# EAGLE schematic esp32 with ws2812b strip (EAGLE 9.3.0)
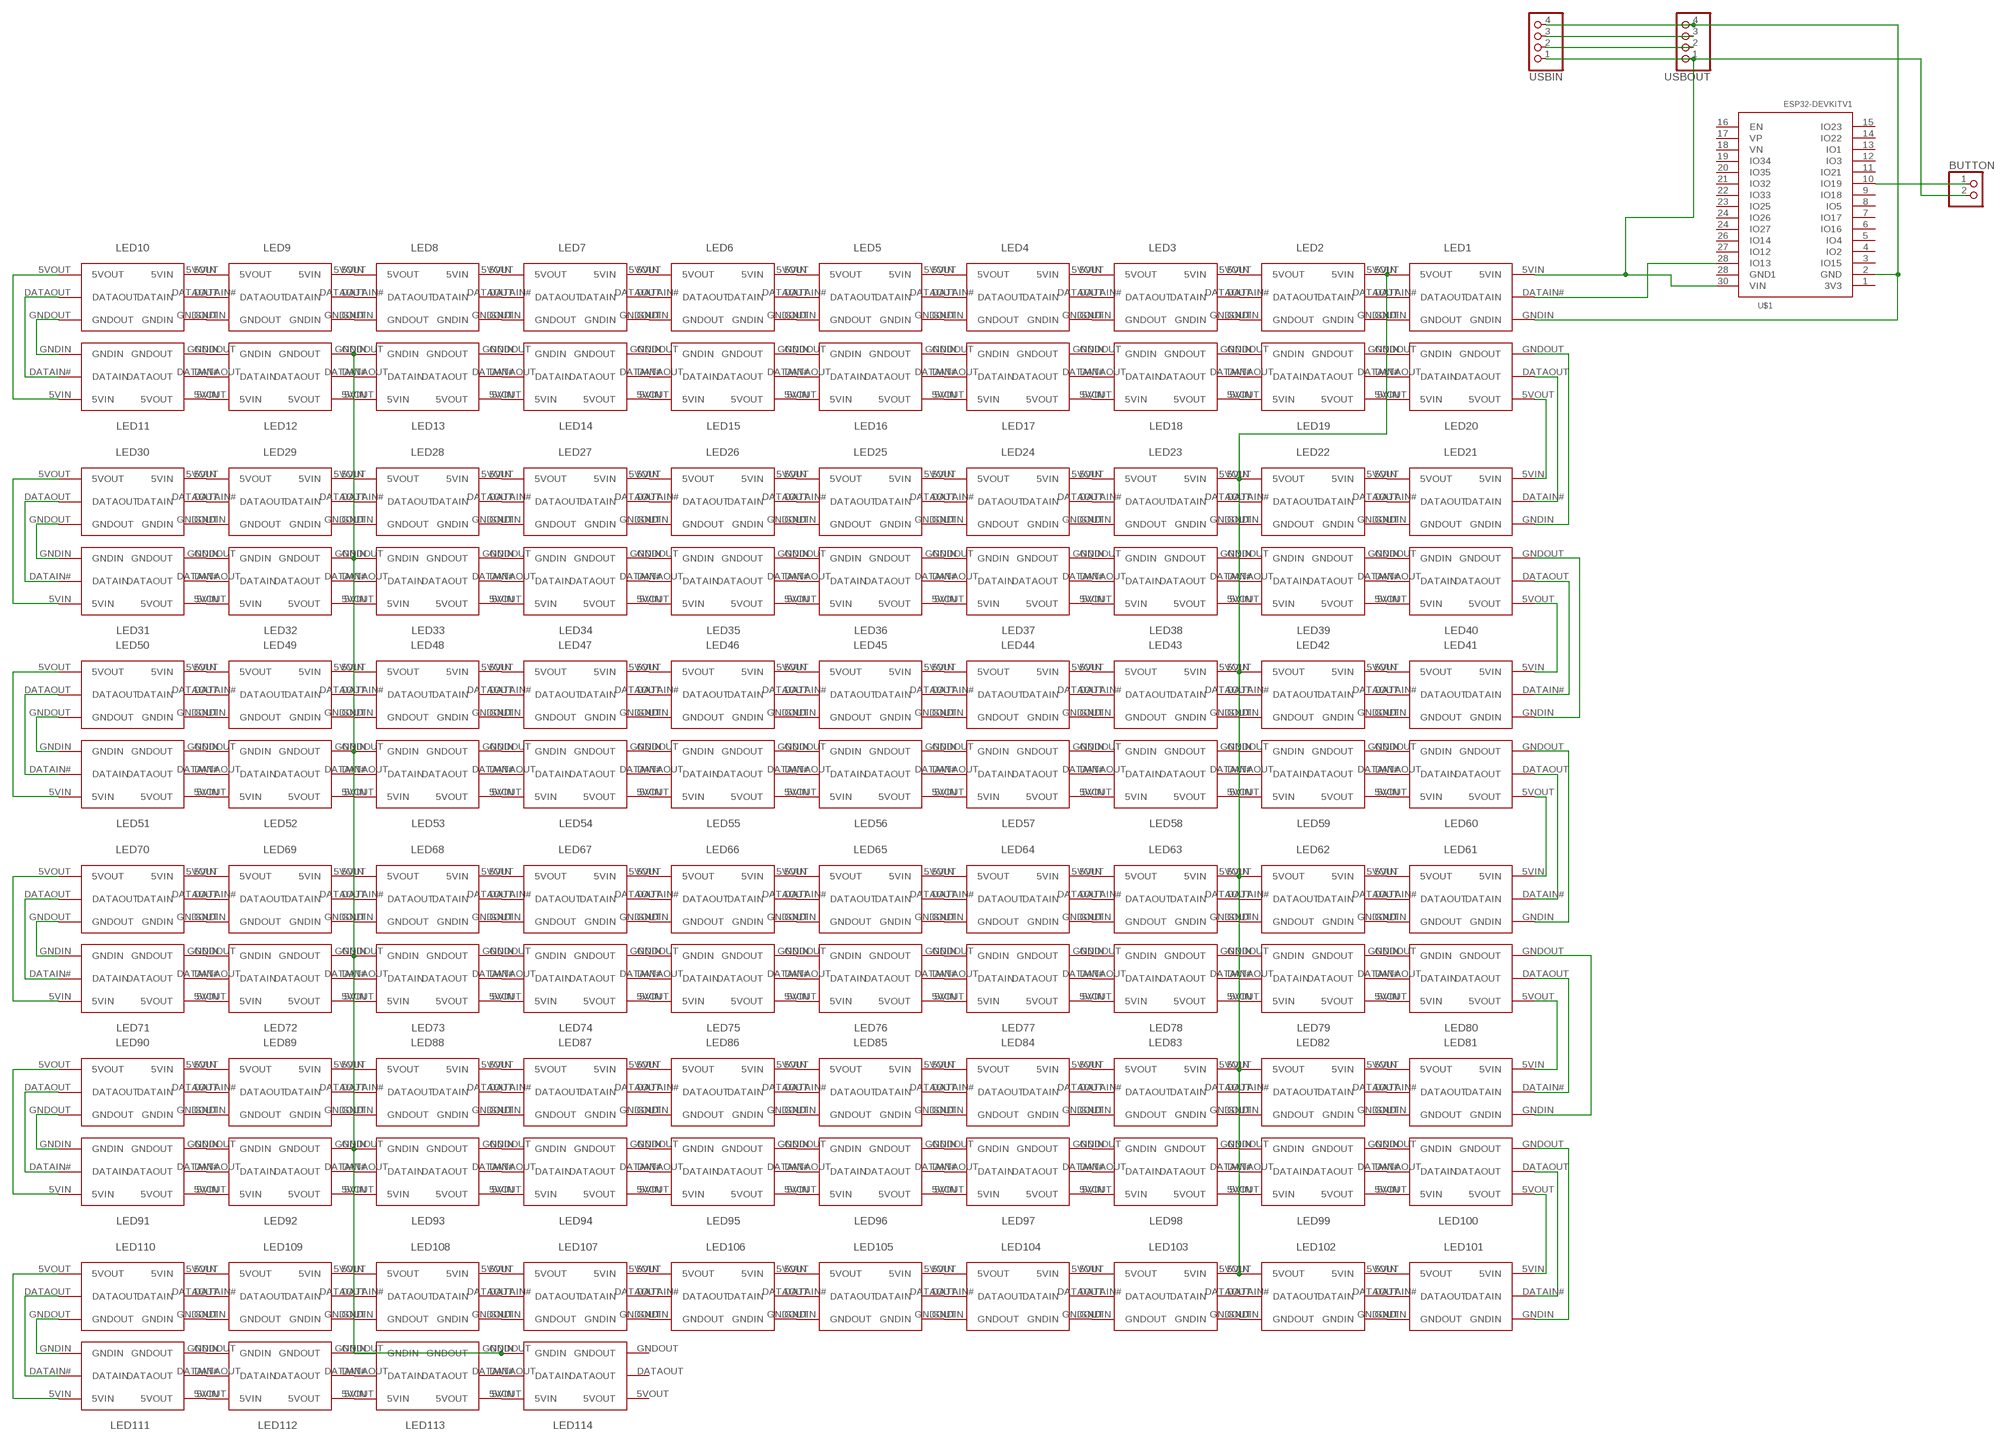
[diagram p0: schematic, sheet 1]

## Parts
BUTTON  PINHD-1X2  [1X02]
LED1  SINGLESTRIP  [SINGLESTRIP]
LED2  SINGLESTRIP  [SINGLESTRIP]
LED3  SINGLESTRIP  [SINGLESTRIP]
LED4  SINGLESTRIP  [SINGLESTRIP]
LED5  SINGLESTRIP  [SINGLESTRIP]
LED6  SINGLESTRIP  [SINGLESTRIP]
LED7  SINGLESTRIP  [SINGLESTRIP]
LED8  SINGLESTRIP  [SINGLESTRIP]
LED9  SINGLESTRIP  [SINGLESTRIP]
LED10  SINGLESTRIP  [SINGLESTRIP]
LED11  SINGLESTRIP  [SINGLESTRIP]
LED12  SINGLESTRIP  [SINGLESTRIP]
LED13  SINGLESTRIP  [SINGLESTRIP]
LED14  SINGLESTRIP  [SINGLESTRIP]
LED15  SINGLESTRIP  [SINGLESTRIP]
LED16  SINGLESTRIP  [SINGLESTRIP]
LED17  SINGLESTRIP  [SINGLESTRIP]
LED18  SINGLESTRIP  [SINGLESTRIP]
LED19  SINGLESTRIP  [SINGLESTRIP]
LED20  SINGLESTRIP  [SINGLESTRIP]
LED21  SINGLESTRIP  [SINGLESTRIP]
LED22  SINGLESTRIP  [SINGLESTRIP]
LED23  SINGLESTRIP  [SINGLESTRIP]
LED24  SINGLESTRIP  [SINGLESTRIP]
LED25  SINGLESTRIP  [SINGLESTRIP]
LED26  SINGLESTRIP  [SINGLESTRIP]
LED27  SINGLESTRIP  [SINGLESTRIP]
LED28  SINGLESTRIP  [SINGLESTRIP]
LED29  SINGLESTRIP  [SINGLESTRIP]
LED30  SINGLESTRIP  [SINGLESTRIP]
LED31  SINGLESTRIP  [SINGLESTRIP]
LED32  SINGLESTRIP  [SINGLESTRIP]
LED33  SINGLESTRIP  [SINGLESTRIP]
LED34  SINGLESTRIP  [SINGLESTRIP]
LED35  SINGLESTRIP  [SINGLESTRIP]
LED36  SINGLESTRIP  [SINGLESTRIP]
LED37  SINGLESTRIP  [SINGLESTRIP]
LED38  SINGLESTRIP  [SINGLESTRIP]
LED39  SINGLESTRIP  [SINGLESTRIP]
LED40  SINGLESTRIP  [SINGLESTRIP]
LED41  SINGLESTRIP  [SINGLESTRIP]
LED42  SINGLESTRIP  [SINGLESTRIP]
LED43  SINGLESTRIP  [SINGLESTRIP]
LED44  SINGLESTRIP  [SINGLESTRIP]
LED45  SINGLESTRIP  [SINGLESTRIP]
LED46  SINGLESTRIP  [SINGLESTRIP]
LED47  SINGLESTRIP  [SINGLESTRIP]
LED48  SINGLESTRIP  [SINGLESTRIP]
LED49  SINGLESTRIP  [SINGLESTRIP]
LED50  SINGLESTRIP  [SINGLESTRIP]
LED51  SINGLESTRIP  [SINGLESTRIP]
LED52  SINGLESTRIP  [SINGLESTRIP]
LED53  SINGLESTRIP  [SINGLESTRIP]
LED54  SINGLESTRIP  [SINGLESTRIP]
LED55  SINGLESTRIP  [SINGLESTRIP]
LED56  SINGLESTRIP  [SINGLESTRIP]
LED57  SINGLESTRIP  [SINGLESTRIP]
LED58  SINGLESTRIP  [SINGLESTRIP]
LED59  SINGLESTRIP  [SINGLESTRIP]
LED60  SINGLESTRIP  [SINGLESTRIP]
LED61  SINGLESTRIP  [SINGLESTRIP]
LED62  SINGLESTRIP  [SINGLESTRIP]
LED63  SINGLESTRIP  [SINGLESTRIP]
LED64  SINGLESTRIP  [SINGLESTRIP]
LED65  SINGLESTRIP  [SINGLESTRIP]
LED66  SINGLESTRIP  [SINGLESTRIP]
LED67  SINGLESTRIP  [SINGLESTRIP]
LED68  SINGLESTRIP  [SINGLESTRIP]
LED69  SINGLESTRIP  [SINGLESTRIP]
LED70  SINGLESTRIP  [SINGLESTRIP]
LED71  SINGLESTRIP  [SINGLESTRIP]
LED72  SINGLESTRIP  [SINGLESTRIP]
LED73  SINGLESTRIP  [SINGLESTRIP]
LED74  SINGLESTRIP  [SINGLESTRIP]
LED75  SINGLESTRIP  [SINGLESTRIP]
LED76  SINGLESTRIP  [SINGLESTRIP]
LED77  SINGLESTRIP  [SINGLESTRIP]
LED78  SINGLESTRIP  [SINGLESTRIP]
LED79  SINGLESTRIP  [SINGLESTRIP]
LED80  SINGLESTRIP  [SINGLESTRIP]
LED81  SINGLESTRIP  [SINGLESTRIP]
LED82  SINGLESTRIP  [SINGLESTRIP]
LED83  SINGLESTRIP  [SINGLESTRIP]
LED84  SINGLESTRIP  [SINGLESTRIP]
LED85  SINGLESTRIP  [SINGLESTRIP]
LED86  SINGLESTRIP  [SINGLESTRIP]
LED87  SINGLESTRIP  [SINGLESTRIP]
LED88  SINGLESTRIP  [SINGLESTRIP]
LED89  SINGLESTRIP  [SINGLESTRIP]
LED90  SINGLESTRIP  [SINGLESTRIP]
LED91  SINGLESTRIP  [SINGLESTRIP]
LED92  SINGLESTRIP  [SINGLESTRIP]
LED93  SINGLESTRIP  [SINGLESTRIP]
LED94  SINGLESTRIP  [SINGLESTRIP]
LED95  SINGLESTRIP  [SINGLESTRIP]
LED96  SINGLESTRIP  [SINGLESTRIP]
LED97  SINGLESTRIP  [SINGLESTRIP]
LED98  SINGLESTRIP  [SINGLESTRIP]
LED99  SINGLESTRIP  [SINGLESTRIP]
LED100  SINGLESTRIP  [SINGLESTRIP]
LED101  SINGLESTRIP  [SINGLESTRIP]
LED102  SINGLESTRIP  [SINGLESTRIP]
LED103  SINGLESTRIP  [SINGLESTRIP]
LED104  SINGLESTRIP  [SINGLESTRIP]
LED105  SINGLESTRIP  [SINGLESTRIP]
LED106  SINGLESTRIP  [SINGLESTRIP]
LED107  SINGLESTRIP  [SINGLESTRIP]
LED108  SINGLESTRIP  [SINGLESTRIP]
LED109  SINGLESTRIP  [SINGLESTRIP]
LED110  SINGLESTRIP  [SINGLESTRIP]
LED111  SINGLESTRIP  [SINGLESTRIP]
LED112  SINGLESTRIP  [SINGLESTRIP]
LED113  SINGLESTRIP  [SINGLESTRIP]
LED114  SINGLESTRIP  [SINGLESTRIP]
U$1  ESP32DEVKITV1  [ESP32-DEVKITV1]
USBIN  PINHD-1X4  [1X04]
USBOUT  PINHD-1X4  [1X04]

## Nets
N$2: LED1.DATAOUT LED2.DATAIN#(DATAIN)
N$3: LED1.GNDOUT LED2.GNDIN
N$4: LED2.5VOUT LED3.5VIN
N$5: LED2.DATAOUT LED3.DATAIN#(DATAIN)
N$6: LED2.GNDOUT LED3.GNDIN
N$7: LED3.5VOUT LED4.5VIN
N$8: LED3.DATAOUT LED4.DATAIN#(DATAIN)
N$9: LED3.GNDOUT LED4.GNDIN
N$10: LED4.5VOUT LED5.5VIN
N$11: LED4.DATAOUT LED5.DATAIN#(DATAIN)
N$12: LED4.GNDOUT LED5.GNDIN
N$13: LED5.5VOUT LED6.5VIN
N$14: LED5.DATAOUT LED6.DATAIN#(DATAIN)
N$15: LED5.GNDOUT LED6.GNDIN
N$16: LED6.5VOUT LED7.5VIN
N$17: LED6.DATAOUT LED7.DATAIN#(DATAIN)
N$18: LED6.GNDOUT LED7.GNDIN
N$19: LED7.5VOUT LED8.5VIN
N$20: LED7.DATAOUT LED8.DATAIN#(DATAIN)
N$21: LED7.GNDOUT LED8.GNDIN
N$22: LED8.5VOUT LED9.5VIN
N$23: LED8.DATAOUT LED9.DATAIN#(DATAIN)
N$24: LED8.GNDOUT LED9.GNDIN
N$25: LED9.5VOUT LED10.5VIN
N$26: LED9.DATAOUT LED10.DATAIN#(DATAIN)
N$27: LED9.GNDOUT LED10.GNDIN
N$28: LED11.5VOUT LED12.5VIN
N$29: LED11.DATAOUT LED12.DATAIN#(DATAIN)
N$30: LED11.GNDOUT LED12.GNDIN
N$31: LED12.5VOUT LED13.5VIN
N$32: LED12.DATAOUT LED13.DATAIN#(DATAIN)
N$33: LED103.5VOUT LED104.5VIN
N$34: LED13.5VOUT LED14.5VIN
N$35: LED13.DATAOUT LED14.DATAIN#(DATAIN)
N$36: LED13.GNDOUT LED14.GNDIN
N$37: LED14.5VOUT LED15.5VIN
N$38: LED14.DATAOUT LED15.DATAIN#(DATAIN)
N$39: LED14.GNDOUT LED15.GNDIN
N$40: LED15.5VOUT LED16.5VIN
N$41: LED15.DATAOUT LED16.DATAIN#(DATAIN)
N$42: LED15.GNDOUT LED16.GNDIN
N$43: LED16.5VOUT LED17.5VIN
N$44: LED16.DATAOUT LED17.DATAIN#(DATAIN)
N$45: LED16.GNDOUT LED17.GNDIN
N$46: LED17.5VOUT LED18.5VIN
N$47: LED17.DATAOUT LED18.DATAIN#(DATAIN)
N$48: LED17.GNDOUT LED18.GNDIN
N$49: LED18.5VOUT LED19.5VIN
N$50: LED18.DATAOUT LED19.DATAIN#(DATAIN)
N$51: LED18.GNDOUT LED19.GNDIN
N$52: LED19.5VOUT LED20.5VIN
N$53: LED19.DATAOUT LED20.DATAIN#(DATAIN)
N$54: LED19.GNDOUT LED20.GNDIN
N$55: LED10.GNDOUT LED11.GNDIN
N$56: LED10.DATAOUT LED11.DATAIN#(DATAIN)
N$57: LED10.5VOUT LED11.5VIN
N$58: LED21.5VOUT LED22.5VIN
N$59: LED21.DATAOUT LED22.DATAIN#(DATAIN)
N$60: LED21.GNDOUT LED22.GNDIN
N$62: LED22.DATAOUT LED23.DATAIN#(DATAIN)
N$63: LED22.GNDOUT LED23.GNDIN
N$64: LED23.5VOUT LED24.5VIN
N$65: LED23.DATAOUT LED24.DATAIN#(DATAIN)
N$66: LED23.GNDOUT LED24.GNDIN
N$67: LED24.5VOUT LED25.5VIN
N$68: LED24.DATAOUT LED25.DATAIN#(DATAIN)
N$69: LED24.GNDOUT LED25.GNDIN
N$70: LED25.5VOUT LED26.5VIN
N$71: LED25.DATAOUT LED26.DATAIN#(DATAIN)
N$72: LED25.GNDOUT LED26.GNDIN
N$73: LED26.5VOUT LED27.5VIN
N$74: LED26.DATAOUT LED27.DATAIN#(DATAIN)
N$75: LED26.GNDOUT LED27.GNDIN
N$76: LED27.5VOUT LED28.5VIN
N$77: LED27.DATAOUT LED28.DATAIN#(DATAIN)
N$78: LED27.GNDOUT LED28.GNDIN
N$79: LED28.5VOUT LED29.5VIN
N$80: LED28.DATAOUT LED29.DATAIN#(DATAIN)
N$81: LED28.GNDOUT LED29.GNDIN
N$82: LED29.5VOUT LED30.5VIN
N$83: LED29.DATAOUT LED30.DATAIN#(DATAIN)
N$84: LED29.GNDOUT LED30.GNDIN
N$85: LED31.5VOUT LED32.5VIN
N$86: LED31.DATAOUT LED32.DATAIN#(DATAIN)
N$87: LED31.GNDOUT LED32.GNDIN
N$88: LED32.5VOUT LED33.5VIN
N$89: LED32.DATAOUT LED33.DATAIN#(DATAIN)
N$91: LED33.5VOUT LED34.5VIN
N$92: LED33.DATAOUT LED34.DATAIN#(DATAIN)
N$93: LED33.GNDOUT LED34.GNDIN
N$94: LED34.5VOUT LED35.5VIN
N$95: LED34.DATAOUT LED35.DATAIN#(DATAIN)
N$96: LED34.GNDOUT LED35.GNDIN
N$97: LED35.5VOUT LED36.5VIN
N$98: LED35.DATAOUT LED36.DATAIN#(DATAIN)
N$99: LED35.GNDOUT LED36.GNDIN
N$100: LED36.5VOUT LED37.5VIN
N$101: LED36.DATAOUT LED37.DATAIN#(DATAIN)
N$102: LED36.GNDOUT LED37.GNDIN
N$103: LED37.5VOUT LED38.5VIN
N$104: LED37.DATAOUT LED38.DATAIN#(DATAIN)
N$105: LED37.GNDOUT LED38.GNDIN
N$106: LED38.5VOUT LED39.5VIN
N$107: LED38.DATAOUT LED39.DATAIN#(DATAIN)
N$108: LED38.GNDOUT LED39.GNDIN
N$109: LED39.5VOUT LED40.5VIN
N$110: LED39.DATAOUT LED40.DATAIN#(DATAIN)
N$111: LED39.GNDOUT LED40.GNDIN
N$112: LED30.GNDOUT LED31.GNDIN
N$113: LED30.DATAOUT LED31.DATAIN#(DATAIN)
N$114: LED30.5VOUT LED31.5VIN
N$115: LED20.5VOUT LED21.5VIN
N$116: LED20.DATAOUT LED21.DATAIN#(DATAIN)
N$117: LED20.GNDOUT LED21.GNDIN
N$118: LED41.5VOUT LED42.5VIN
N$119: LED41.DATAOUT LED42.DATAIN#(DATAIN)
N$120: LED41.GNDOUT LED42.GNDIN
N$122: LED42.DATAOUT LED43.DATAIN#(DATAIN)
N$123: LED42.GNDOUT LED43.GNDIN
N$124: LED43.5VOUT LED44.5VIN
N$125: LED43.DATAOUT LED44.DATAIN#(DATAIN)
N$126: LED43.GNDOUT LED44.GNDIN
N$127: LED44.5VOUT LED45.5VIN
N$128: LED44.DATAOUT LED45.DATAIN#(DATAIN)
N$129: LED44.GNDOUT LED45.GNDIN
N$130: LED45.5VOUT LED46.5VIN
N$131: LED45.DATAOUT LED46.DATAIN#(DATAIN)
N$132: LED45.GNDOUT LED46.GNDIN
N$133: LED46.5VOUT LED47.5VIN
N$134: LED46.DATAOUT LED47.DATAIN#(DATAIN)
N$135: LED46.GNDOUT LED47.GNDIN
N$136: LED47.5VOUT LED48.5VIN
N$137: LED47.DATAOUT LED48.DATAIN#(DATAIN)
N$138: LED47.GNDOUT LED48.GNDIN
N$139: LED48.5VOUT LED49.5VIN
N$140: LED48.DATAOUT LED49.DATAIN#(DATAIN)
N$141: LED48.GNDOUT LED49.GNDIN
N$142: LED49.5VOUT LED50.5VIN
N$143: LED49.DATAOUT LED50.DATAIN#(DATAIN)
N$144: LED49.GNDOUT LED50.GNDIN
N$145: LED51.5VOUT LED52.5VIN
N$146: LED51.DATAOUT LED52.DATAIN#(DATAIN)
N$147: LED51.GNDOUT LED52.GNDIN
N$148: LED52.5VOUT LED53.5VIN
N$149: LED52.DATAOUT LED53.DATAIN#(DATAIN)
N$151: LED53.5VOUT LED54.5VIN
N$152: LED53.DATAOUT LED54.DATAIN#(DATAIN)
N$153: LED53.GNDOUT LED54.GNDIN
N$154: LED54.5VOUT LED55.5VIN
N$155: LED54.DATAOUT LED55.DATAIN#(DATAIN)
N$156: LED54.GNDOUT LED55.GNDIN
N$157: LED55.5VOUT LED56.5VIN
N$158: LED55.DATAOUT LED56.DATAIN#(DATAIN)
N$159: LED55.GNDOUT LED56.GNDIN
N$160: LED56.5VOUT LED57.5VIN
N$161: LED56.DATAOUT LED57.DATAIN#(DATAIN)
N$162: LED56.GNDOUT LED57.GNDIN
N$163: LED57.5VOUT LED58.5VIN
N$164: LED57.DATAOUT LED58.DATAIN#(DATAIN)
N$165: LED57.GNDOUT LED58.GNDIN
N$166: LED58.5VOUT LED59.5VIN
N$167: LED58.DATAOUT LED59.DATAIN#(DATAIN)
N$168: LED58.GNDOUT LED59.GNDIN
N$169: LED59.5VOUT LED60.5VIN
N$170: LED59.DATAOUT LED60.DATAIN#(DATAIN)
N$171: LED59.GNDOUT LED60.GNDIN
N$172: LED50.GNDOUT LED51.GNDIN
N$173: LED50.DATAOUT LED51.DATAIN#(DATAIN)
N$174: LED50.5VOUT LED51.5VIN
N$175: LED61.5VOUT LED62.5VIN
N$176: LED61.DATAOUT LED62.DATAIN#(DATAIN)
N$177: LED61.GNDOUT LED62.GNDIN
N$179: LED62.DATAOUT LED63.DATAIN#(DATAIN)
N$180: LED62.GNDOUT LED63.GNDIN
N$181: LED63.5VOUT LED64.5VIN
N$182: LED63.DATAOUT LED64.DATAIN#(DATAIN)
N$183: LED63.GNDOUT LED64.GNDIN
N$184: LED64.5VOUT LED65.5VIN
N$185: LED64.DATAOUT LED65.DATAIN#(DATAIN)
N$186: LED64.GNDOUT LED65.GNDIN
N$187: LED65.5VOUT LED66.5VIN
N$188: LED65.DATAOUT LED66.DATAIN#(DATAIN)
N$189: LED65.GNDOUT LED66.GNDIN
N$190: LED66.5VOUT LED67.5VIN
N$191: LED66.DATAOUT LED67.DATAIN#(DATAIN)
N$192: LED66.GNDOUT LED67.GNDIN
N$193: LED67.5VOUT LED68.5VIN
N$194: LED67.DATAOUT LED68.DATAIN#(DATAIN)
N$195: LED67.GNDOUT LED68.GNDIN
N$196: LED68.5VOUT LED69.5VIN
N$197: LED68.DATAOUT LED69.DATAIN#(DATAIN)
N$198: LED68.GNDOUT LED69.GNDIN
N$199: LED69.5VOUT LED70.5VIN
N$200: LED69.DATAOUT LED70.DATAIN#(DATAIN)
N$201: LED69.GNDOUT LED70.GNDIN
N$202: LED71.5VOUT LED72.5VIN
N$203: LED71.DATAOUT LED72.DATAIN#(DATAIN)
N$204: LED71.GNDOUT LED72.GNDIN
N$205: LED72.5VOUT LED73.5VIN
N$206: LED72.DATAOUT LED73.DATAIN#(DATAIN)
N$208: LED73.5VOUT LED74.5VIN
N$209: LED73.DATAOUT LED74.DATAIN#(DATAIN)
N$210: LED73.GNDOUT LED74.GNDIN
N$211: LED74.5VOUT LED75.5VIN
N$212: LED74.DATAOUT LED75.DATAIN#(DATAIN)
N$213: LED74.GNDOUT LED75.GNDIN
N$214: LED75.5VOUT LED76.5VIN
N$215: LED75.DATAOUT LED76.DATAIN#(DATAIN)
N$216: LED75.GNDOUT LED76.GNDIN
N$217: LED76.5VOUT LED77.5VIN
N$218: LED76.DATAOUT LED77.DATAIN#(DATAIN)
N$219: LED76.GNDOUT LED77.GNDIN
N$220: LED77.5VOUT LED78.5VIN
N$221: LED77.DATAOUT LED78.DATAIN#(DATAIN)
N$222: LED77.GNDOUT LED78.GNDIN
N$223: LED78.5VOUT LED79.5VIN
N$224: LED78.DATAOUT LED79.DATAIN#(DATAIN)
N$225: LED78.GNDOUT LED79.GNDIN
N$226: LED79.5VOUT LED80.5VIN
N$227: LED79.DATAOUT LED80.DATAIN#(DATAIN)
N$228: LED79.GNDOUT LED80.GNDIN
N$229: LED70.GNDOUT LED71.GNDIN
N$230: LED70.DATAOUT LED71.DATAIN#(DATAIN)
N$231: LED70.5VOUT LED71.5VIN
N$232: LED60.5VOUT LED61.5VIN
N$233: LED60.DATAOUT LED61.DATAIN#(DATAIN)
N$234: LED60.GNDOUT LED61.GNDIN
N$235: LED40.5VOUT LED41.5VIN
N$236: LED40.DATAOUT LED41.DATAIN#(DATAIN)
N$237: LED40.GNDOUT LED41.GNDIN
N$238: LED81.5VOUT LED82.5VIN
N$239: LED81.DATAOUT LED82.DATAIN#(DATAIN)
N$240: LED81.GNDOUT LED82.GNDIN
N$242: LED82.DATAOUT LED83.DATAIN#(DATAIN)
N$243: LED82.GNDOUT LED83.GNDIN
N$244: LED83.5VOUT LED84.5VIN
N$245: LED83.DATAOUT LED84.DATAIN#(DATAIN)
N$246: LED83.GNDOUT LED84.GNDIN
N$247: LED84.5VOUT LED85.5VIN
N$248: LED84.DATAOUT LED85.DATAIN#(DATAIN)
N$249: LED84.GNDOUT LED85.GNDIN
N$250: LED85.5VOUT LED86.5VIN
N$251: LED85.DATAOUT LED86.DATAIN#(DATAIN)
N$252: LED85.GNDOUT LED86.GNDIN
N$253: LED86.5VOUT LED87.5VIN
N$254: LED86.DATAOUT LED87.DATAIN#(DATAIN)
N$255: LED86.GNDOUT LED87.GNDIN
N$256: LED87.5VOUT LED88.5VIN
N$257: LED87.DATAOUT LED88.DATAIN#(DATAIN)
N$258: LED87.GNDOUT LED88.GNDIN
N$259: LED88.5VOUT LED89.5VIN
N$260: LED88.DATAOUT LED89.DATAIN#(DATAIN)
N$261: LED88.GNDOUT LED89.GNDIN
N$262: LED89.5VOUT LED90.5VIN
N$263: LED89.DATAOUT LED90.DATAIN#(DATAIN)
N$264: LED89.GNDOUT LED90.GNDIN
N$265: LED91.5VOUT LED92.5VIN
N$266: LED91.DATAOUT LED92.DATAIN#(DATAIN)
N$267: LED91.GNDOUT LED92.GNDIN
N$268: LED92.5VOUT LED93.5VIN
N$269: LED92.DATAOUT LED93.DATAIN#(DATAIN)
N$271: LED93.5VOUT LED94.5VIN
N$272: LED93.DATAOUT LED94.DATAIN#(DATAIN)
N$273: LED93.GNDOUT LED94.GNDIN
N$274: LED94.5VOUT LED95.5VIN
N$275: LED94.DATAOUT LED95.DATAIN#(DATAIN)
N$276: LED94.GNDOUT LED95.GNDIN
N$277: LED95.5VOUT LED96.5VIN
N$278: LED95.DATAOUT LED96.DATAIN#(DATAIN)
N$279: LED95.GNDOUT LED96.GNDIN
N$280: LED96.5VOUT LED97.5VIN
N$281: LED96.DATAOUT LED97.DATAIN#(DATAIN)
N$282: LED96.GNDOUT LED97.GNDIN
N$283: LED97.5VOUT LED98.5VIN
N$284: LED97.DATAOUT LED98.DATAIN#(DATAIN)
N$285: LED97.GNDOUT LED98.GNDIN
N$286: LED98.5VOUT LED99.5VIN
N$287: LED98.DATAOUT LED99.DATAIN#(DATAIN)
N$288: LED98.GNDOUT LED99.GNDIN
N$289: LED99.5VOUT LED100.5VIN
N$290: LED99.DATAOUT LED100.DATAIN#(DATAIN)
N$291: LED99.GNDOUT LED100.GNDIN
N$292: LED90.GNDOUT LED91.GNDIN
N$293: LED90.DATAOUT LED91.DATAIN#(DATAIN)
N$294: LED90.5VOUT LED91.5VIN
N$295: LED101.5VOUT LED102.5VIN
N$296: LED101.DATAOUT LED102.DATAIN#(DATAIN)
N$297: LED101.GNDOUT LED102.GNDIN
N$299: LED102.DATAOUT LED103.DATAIN#(DATAIN)
N$300: LED102.GNDOUT LED103.GNDIN
N$301: LED1.5VOUT LED2.5VIN LED22.5VOUT LED23.5VIN LED42.5VOUT LED43.5VIN LED62.5VOUT LED63.5VIN LED82.5VOUT LED83.5VIN LED102.5VOUT LED103.5VIN
N$302: LED103.DATAOUT LED104.DATAIN#(DATAIN)
N$303: LED103.GNDOUT LED104.GNDIN
N$304: LED104.5VOUT LED105.5VIN
N$305: LED104.DATAOUT LED105.DATAIN#(DATAIN)
N$306: LED104.GNDOUT LED105.GNDIN
N$307: LED105.5VOUT LED106.5VIN
N$308: LED105.DATAOUT LED106.DATAIN#(DATAIN)
N$309: LED105.GNDOUT LED106.GNDIN
N$310: LED106.5VOUT LED107.5VIN
N$311: LED106.DATAOUT LED107.DATAIN#(DATAIN)
N$312: LED106.GNDOUT LED107.GNDIN
N$313: LED107.5VOUT LED108.5VIN
N$314: LED107.DATAOUT LED108.DATAIN#(DATAIN)
N$315: LED107.GNDOUT LED108.GNDIN
N$316: LED108.5VOUT LED109.5VIN
N$317: LED108.DATAOUT LED109.DATAIN#(DATAIN)
N$318: LED108.GNDOUT LED109.GNDIN
N$319: LED109.5VOUT LED110.5VIN
N$320: LED109.DATAOUT LED110.DATAIN#(DATAIN)
N$321: LED109.GNDOUT LED110.GNDIN
N$322: LED111.5VOUT LED112.5VIN
N$323: LED111.DATAOUT LED112.DATAIN#(DATAIN)
N$324: LED111.GNDOUT LED112.GNDIN
N$325: LED112.5VOUT LED113.5VIN
N$326: LED112.DATAOUT LED113.DATAIN#(DATAIN)
N$327: LED112.GNDOUT LED113.GNDIN
N$328: LED113.5VOUT LED114.5VIN
N$329: LED113.DATAOUT LED114.DATAIN#(DATAIN)
N$330: LED12.GNDOUT LED13.GNDIN LED32.GNDOUT LED33.GNDIN LED52.GNDOUT LED53.GNDIN LED72.GNDOUT LED73.GNDIN LED92.GNDOUT LED93.GNDIN LED113.GNDOUT LED114.GNDIN
N$331: LED80.5VOUT LED81.5VIN
N$332: LED80.DATAOUT LED81.DATAIN#(DATAIN)
N$333: LED80.GNDOUT LED81.GNDIN
N$334: LED1.GNDIN U$1.2(GND) USBIN.4 USBOUT.4
N$335: BUTTON.2 LED1.5VIN U$1.30(VIN) USBIN.1 USBOUT.1
N$336: LED1.DATAIN#(DATAIN) U$1.28(IO13)
N$337: BUTTON.1 U$1.10(IO19)
N$338: USBIN.3 USBOUT.3
N$339: USBIN.2 USBOUT.2
N$349: LED110.GNDOUT LED111.GNDIN
N$350: LED110.DATAOUT LED111.DATAIN#(DATAIN)
N$351: LED110.5VOUT LED111.5VIN
N$352: LED100.5VOUT LED101.5VIN
N$353: LED100.DATAOUT LED101.DATAIN#(DATAIN)
N$354: LED100.GNDOUT LED101.GNDIN
Unconnected: LED114.DATAOUT U$1.1(3V3) U$1.3(IO15) U$1.4(IO2) U$1.5(IO4) U$1.6(IO16) U$1.7(IO17) U$1.8(IO5) U$1.9(IO18) U$1.11(IO21) U$1.12(IO3) U$1.13(IO1) U$1.14(IO22) U$1.15(IO23) U$1.16(EN) U$1.17(VP) U$1.18(VN) U$1.19(IO34) U$1.20(IO35) U$1.21(IO32) U$1.22(IO33) U$1.23(IO25) U$1.24(IO26) U$1.24(IO27) U$1.26(IO14) U$1.27(IO12) U$1.28(GND1)

## Power pins joined to a net without a drawn wire
5VOUT: LED114.5VOUT
GNDOUT: LED114.GNDOUT

## Library data of the parts
BUTTON = pinhead:PINHD-1X2: PIN HEADER
LED1-LED114 = ws2812b:SINGLESTRIP
U$1 = ESP32-DEVKITV1:ESP32DEVKITV1
USBIN USBOUT = pinhead:PINHD-1X4: PIN HEADER